# Altium schematic sheet Battery_Connector.SchDoc: =SheetTitle
size A4; SheetTitle: Battery Connector; DrawnBy: Samyar Sadat Akhavi; DocumentNumber: 5; SheetNumber: 5; SheetTotal: 5
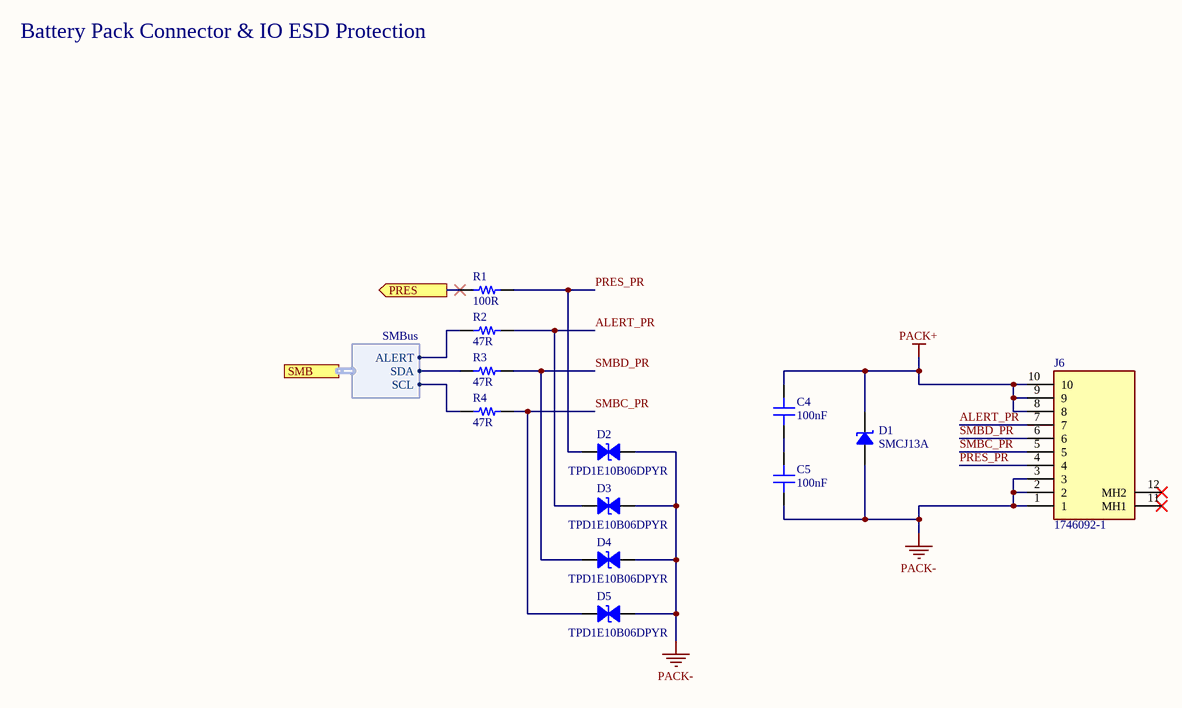
[diagram p0: Battery_Connector.SchDoc]

## Parts
?  (no value)  (graphical)
C4  100nF  [CAP 0603_1608]
C5  100nF  [CAP 0603_1608]
D1  SMCJ13A  [DO214AB SMC]
D2  TPD1E10B06DPYR  [0402]
D3  TPD1E10B06DPYR  [0402]
D4  TPD1E10B06DPYR  [0402]
D5  TPD1E10B06DPYR  [0402]
J6  1746092-1  [17460921]
R1  100R  [RES 0603_1608]
R2  47R  [RES 0603_1608]
R3  47R  [RES 0603_1608]
R4  47R  [RES 0603_1608]

## Ports
PRES (out, see Pack_BMS_Module[3B], Battery_Management[5C]), SMB (harness SMBus, see Pack_BMS_Module[3B], Battery_Management[6C])

## Harnesses
SMBus: ALERT, SDA, SCL

## Nets
PACK+: C4.2 D1.2 J6.8 J6.9 J6.10
PACK-: C5.1 D1.1 D2.1 D3.1 D4.1 D5.1 J6.1 J6.2 J6.3
ALERT_PR: D3.2 J6.7 R2.2
PRES: R1.2 ; port PRES
PRES_PR: D2.2 J6.4 R1.1
SMBC_PR: D5.2 J6.5 R4.2
SMBD_PR: D4.2 J6.6 R3.2
NetC4_1: C4.1 C5.2
NetR2_1: R2.1 ; port SMB.ALERT
NetR3_1: R3.1 ; port SMB.SDA
NetR4_1: R4.1 ; port SMB.SCL

Not connected (* = marked no-connect by the designer): J6 11(MH1)* 12(MH2)*

## Notes on the sheet
- Battery Pack Connector & IO ESD Protection
- Sub-Project:
- Size:
- Drawn By:
- Revision:
- Date:
- File:
- Sheet:
- of

## Library data of the parts
? = SGR-STDTBSA4: STANDARD SCHEMATICS TITLE BLOCK
C4 C5 = GEN-CC100NT10V25KX7R603: GENERIC 0603 MLC CAPACITOR; Tolerance: ±10%; Voltage: 25V; Dielectric: X7R; Part Number: GEN-CC100NT10V25KX7R603; Value: 100nF
D1 = SMCJ13A: TVS DIODE 13VWM 21.5VC DO214AB; Manufacturer: Littelfuse Inc.; Current - Peak Pulse (10/1000µs): 69.8A; Power Line Protection: No; Power - Peak Pulse: 1500W (1.5kW); Type: Zener; Unidirectional Channels: 1; Voltage - Breakdown (Min): 14.4V; Voltage - Clamping (Max) @ Ipp: 21.5V; Voltage - Reverse Standoff (Typ): 13V; Part Number: SMCJ13A; Applications: General Purpose; ComponentLink1Description: Datasheet; ComponentLink1URL: https://www.littelfuse.com/products/tvs-diodes/surface-mount/~/media/electronics/datasheets/tvs_diodes/littelfuse_tvs_diode_smcj_datasheet.pdf.pdf; ComponentLink2Description: DigiKey Link; ComponentLink2URL: https://www.digikey.com/en/products/detail/littelfuse-inc/SMCJ13A/762378; LastUpdated: 4/5/2026 8:33:56 PM; Lifecycle Status: Active; Minimum Order: 1; Mounting Type: Surface Mount; Operating Temperature: -55°C ~ 150°C (TJ); Package / Case: DO-214AB, SMC; Packaging: TapeAndReel; PartId: 6718; Part Status: Active; Price: 0.16; Series: SMCJ; Supplier 1: DigiKey; Supplier Part Number 1: SMCJ13ALFCT-ND; Supplier Device Package: DO-214AB (SMCJ)
D2-D5 = TPD1E10B06DPYR: TVS DIODE 5.5VWM 14VC 2X1SON; Manufacturer: Texas Instruments; Bidirectional Channels: 1; Current - Peak Pulse (10/1000µs): 5A (8/20µs); Power Line Protection: No; Power - Peak Pulse: 90W; Type: Zener; Voltage - Breakdown (Min): 6V; Voltage - Clamping (Max) @ Ipp: 14V; Voltage - Reverse Standoff (Typ): 5.5V (Max); Part Number: TPD1E10B06DPYR; Applications: General Purpose; ComponentLink1Description: Datasheet; ComponentLink1URL: http://www.ti.com/general/docs/suppproductinfo.tsp?distId=10&gotoUrl=http%3A%2F%2Fwww.ti.com%2Flit%2Fgpn%2Ftpd1e10b06; ComponentLink2Description: DigiKey Link; ComponentLink2URL: https://www.digikey.com/en/products/detail/texas-instruments/TPD1E10B06DPYR/3197744; Device Package: 0402 (1005 Metric); LastUpdated: 4/5/2026 9:01:53 PM; Lifecycle Status: Active; Minimum Order: 1; Mounting Type: Surface Mount; Operating Temperature: -40°C ~ 125°C (TA); Package / Case: 0402 (1005 Metric); Packaging: TapeAndReel; PartId: 10446; Part Status: Active; Price: 0.04; Series: -; Supplier 1: DigiKey; Supplier Part Number 1: 296-30406-1-ND; Supplier Device Package: 2-X1SON (1x.60)
J6 = 1746092-1: CONN PLUG 10POS 2.50MM R/A SLDR; Manufacturer: TE Connectivity AMP Connectors; Part Number: 1746092-1; Supplier 1: DigiKey; Supplier Part Number 1: A107791-ND
R1 = GEN-CRR100T1P8603: GENERIC 0603 CHIP RESISTOR; Tolerance: ±1%; Power: 0.125W; Part Number: GEN-CRR100T1P8603; Value: 100R
R2-R4 = GEN-CRR47T1P8603: GENERIC 0603 CHIP RESISTOR; Tolerance: ±1%; Power: 0.125W; Part Number: GEN-CRR47T1P8603; Value: 47R